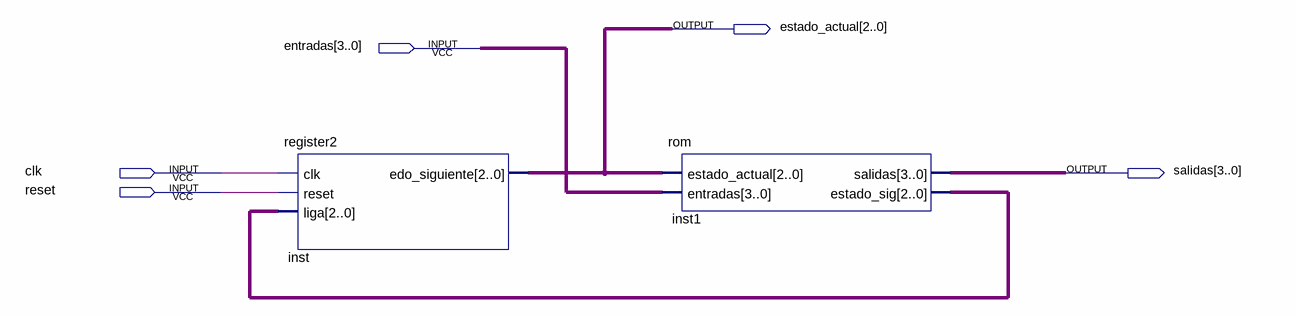
[diagram p0: schematic sheet]
// Quartus schematic practica2.bdf as structural Verilog: 2 symbols, 5 pins
module practica2 (
  input  [3:0] entradas,
  input  clk,
  input  reset,
  output [2:0] estado_actual,
  output [3:0] salidas
);

  wire [2:0] inst1_estado_sig;

  register2 inst (.clk(clk), .reset(reset), .liga(inst1_estado_sig), .edo_siguiente(estado_actual));
  rom inst1 (.estado_actual(estado_actual), .entradas(entradas), .salidas(salidas), .estado_sig(inst1_estado_sig));
endmodule
